# Altium schematic sheet LP_ECG_ECG-X01.SchDoc: ECG
size Letter; Organization: GEORGIA TECH; Address1: NORTH AVE NW; Address2: ATLANTA, GA, 30332; DocumentNumber: P001; Revision: X01; SheetNumber: 4; SheetTotal: 4
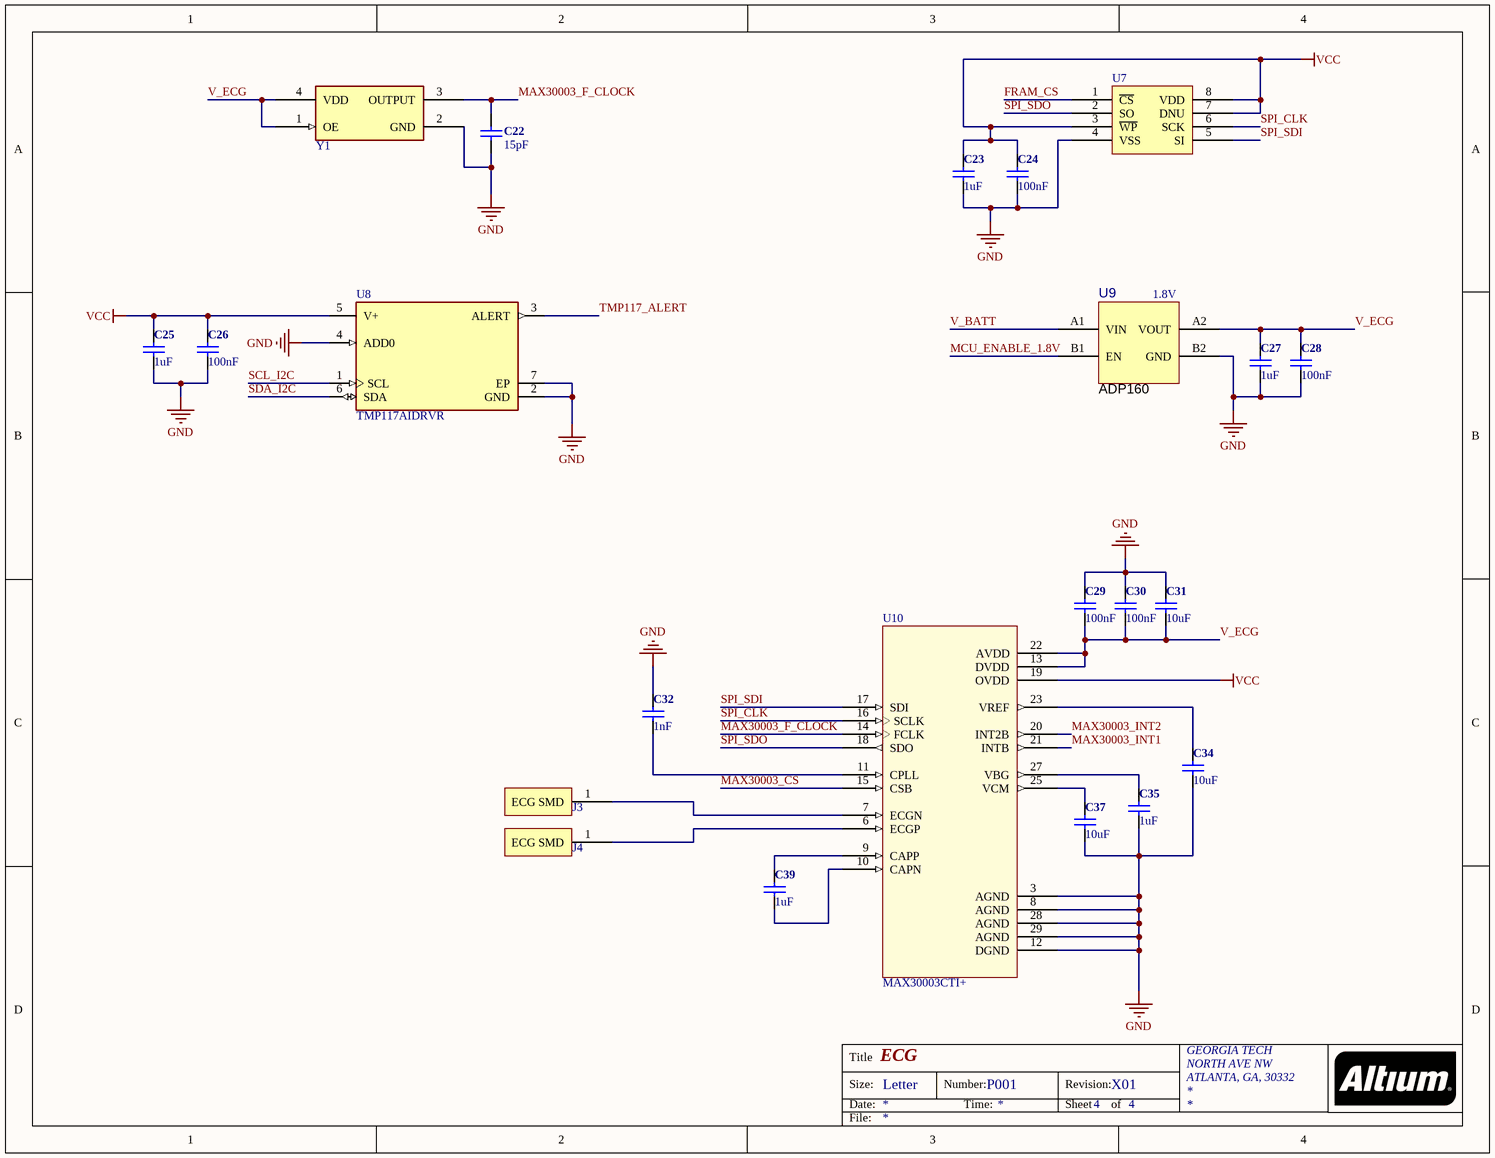
[diagram p0: LP_ECG_ECG-X01.SchDoc]

## Parts
C22  15pF  [C0402]
C23  1uF  [C0402]
C24  100nF  [C0402]
C25  1uF  [C0402]
C26  100nF  [C0402]
C27  1uF  [C0402]
C28  100nF  [C0402]
C29  100nF  [C0402]
C30  100nF  [C0402]
C31  10uF  [C0402]
C32  1nF  [C0402]
C34  10uF  [C0402]
C35  1uF  [C0402]
C37  10uF  [C0402]
C39  1uF  [C0402]
J3  ECG_SMD_CONNECTOR  [ecg_connector]  (value not drawn)
J4  ECG_SMD_CONNECTOR  [ecg_connector]  (value not drawn)
U7  8 MB FRAM  [GQFN-8]  (value not drawn)
U8  TMP117AIDRVR  [TMP117AIDRVR]
U9  ADP160  Output Voltage: 1.8V  [ADP160]
U10  MAX30003CTI+  [QFN50P500X500X80-29N]
Y1  OSCILLATOR-32.768KHZ  [OSCILLATOR_4-SMD]  (value not drawn)

## Nets
GND: C22.2 C23.2 C24.1 C25.2 C26.1 C27.2 C28.1 C29.1 C30.1 C31.1 C32.1 C34.2 C35.2 C37.2 U7.4(VSS) U8.2(GND) U8.4(ADD0) U8.7(EP) U9.B2(GND) U10.3(AGND) U10.8(AGND) U10.12(DGND) U10.28(AGND) U10.29(AGND) Y1.2(GND)
VCC: C23.1 C24.2 C25.1 C26.2 U7.3(~{WP}) U7.7(DNU) U7.8(VDD) U8.5(V+) U10.19(OVDD)
FRAM_CS: U7.1(~{CS})
MAX30003_CS: U10.15(CSB)
MAX30003_F_CLOCK: C22.1 U10.14(FCLK) Y1.3(OUTPUT)
MAX30003_INT1: U10.21(INTB)
MAX30003_INT2: U10.20(INT2B)
MCU_ENABLE_1.8V: U9.B1(EN)
SCL_I2C: U8.1(SCL)
SDA_I2C: U8.6(SDA)
SPI_CLK: U7.6(SCK) U10.16(SCLK)
SPI_SDI: U7.5(SI) U10.17(SDI)
SPI_SDO: U7.2(SO) U10.18(SDO)
TMP117_ALERT: U8.3(ALERT)
V_BATT: U9.A1(VIN)
V_ECG: C27.1 C28.2 C29.2 C30.2 C31.2 U9.A2(VOUT) U10.13(DVDD) U10.22(AVDD) Y1.1(OE) Y1.4(VDD)
NetC32_2: C32.2 U10.11(CPLL)
NetC34_1: C34.1 U10.23(VREF)
NetC35_1: C35.1 U10.27(VBG)
NetC37_1: C37.1 U10.25(VCM)
NetC39_1: C39.1 U10.9(CAPP)
NetC39_2: C39.2 U10.10(CAPN)
NetJ3_1: J3.1(ECG_SMD) U10.7(ECGN)
NetJ4_1: J4.1(ECG_SMD) U10.6(ECGP)

## Notes on the sheet
- Title
- Size:
- Date:
- Letter
- Number:
- Time:
- Revision:
- Sheet
- of
- File:

## Library data of the parts
C22 = C-0402(1005): Ceramic Capacitor, Multilayer, Ceramic, 50V, 1% +Tol, 1% -Tol, C0G, -/+30ppm/Cel TC, 0.000015uF, Surface Mount, 0402; Manufacturer: Murata; Manufacturer Part Number: GJM1555C1H150FB01D; ComponentLink1URL: https://datasheet.ciiva.com/169/product-169683.pdf; ComponentLink1Description: https://datasheet.ciiva.com/169/product-169683.pdf; Supplier 1: Digi-Key; Supplier Part Number 1: 490-11191-1-ND; RoHS: Yes; Category: Ceramic Capacitors; Stock 1: 66158; Pricing 1: 1=0.24000, 10=0.16700, 50=0.10000, 100=0.08440, 500=0.05778, 1000=0.05111, 2500=0.04888, 5000=0.04444 (USD); Mount: Surface Mount; Case/Package: 0402; Case Code (Imperial): 0402; Case Code (Metric): 1005; Min Operating Temperature: -55°C; Max Operating Temperature: 125°C; Capacitance: 15pF; Tolerance: 1%; Packaging: Tape and Reel; Voltage Rating: 50V; Voltage Rating (DC): 50V; Package Quantity: 10000; Dielectric: C0G; Termination: SMD/SMT; Voltage: 50V; Length: 1mm; Height: 0.5mm; Width: 0.02inch; Thickness: 0.022inch; Depth: 0.5mm; Radiation Hardening: No; ComponentLink2URL: https://datasheet.ciiva.com:443/pdfs/VipMasterIC/IC/MURE/MURE-S-A0004383799/MURE-S-A0004384018-1.pdf?src-supplier=IHS+Markit; ComponentLink2Description: https://datasheet.ciiva.com:443/pdfs/VipMasterIC/IC/MURE/MURE-S-A0004383799/MURE-S-A0004384018-1.pdf?src-supplier=IHS+Markit; ComponentLink3URL: https://datasheet.ciiva.com/11608/c02e-11608383.pdf?src-supplier=Avnet; ComponentLink3Description: https://datasheet.ciiva.com/11608/c02e-11608383.pdf?src-supplier=Avnet
C23 C25 C27 C35 C39 = C-0402(1005): Ceramic Capacitor, Multilayer, Ceramic, 6.3V, 20% +Tol, 20% -Tol, X5R, 15% TC, 1uF, Surface Mount, 0402; Manufacturer: Yageo; Manufacturer Part Number: CC0402MRX5R5BB105; Dissipation Factor: 10%; ComponentLink1URL: https://datasheet.ciiva.com/169/product-169683.pdf; ComponentLink1Description: https://datasheet.ciiva.com/169/product-169683.pdf; Supplier 1: Digi-Key; Supplier Part Number 1: 311-1441-1-ND; RoHS: Yes; Category: Ceramic Capacitors; Stock 1: 16697; Pricing 1: 1=0.13000, 10=0.08900, 100=0.04200, 500=0.02946, 1000=0.02439, 2500=0.02270, 5000=0.02076 (USD); Mount: Surface Mount; Case/Package: 0402; Number of Pins: 2; Case Code (Imperial): 0402; Case Code (Metric): 1005; Min Operating Temperature: -55°C; Max Operating Temperature: 85°C; Capacitance: 1uF; Tolerance: 20%; Voltage Rating: 6.3V; Voltage Rating (DC): 6.3V; Packaging: Tape and Reel; Package Quantity: 1; Dielectric: X5R; Termination: SMD/SMT; Composition: Ceramic; Length: 1mm; Height: 0.5mm; Width: 0.5mm; Thickness: 0.022inch; Depth: 0.5mm; Lead Free: Lead Free; Halogen Free: Halogen Free; ComponentLink2URL: https://datasheet.ciiva.com:443/pdfs/VipMasterIC/IC/YAGO/YAGO-S-A0006851646/YAGO-S-A0006851646-1.pdf?src-supplier=IHS+Markit; ComponentLink2Description: https://datasheet.ciiva.com:443/pdfs/VipMasterIC/IC/YAGO/YAGO-S-A0006851646/YAGO-S-A0006851646-1.pdf?src-supplier=IHS+Markit; ComponentLink3URL: https://datasheet.ciiva.com/176/mlccorderingcode-176806.pdf?src-supplier=Digi-Key; ComponentLink3Description: https://datasheet.ciiva.com/176/mlccorderingcode-176806.pdf?src-supplier=Digi-Key; ComponentLink4URL: https://datasheet.ciiva.com/176/mlccorderingcode-176807.pdf?src-supplier=Digi-Key; ComponentLink4Description: https://datasheet.ciiva.com/176/mlccorderingcode-176807.pdf?src-supplier=Digi-Key; ComponentLink5URL: https://datasheet.ciiva.com/176/mlccorderingcode-176808.pdf?src-supplier=Digi-Key; ComponentLink5Description: https://datasheet.ciiva.com/176/mlccorderingcode-176808.pdf?src-supplier=Digi-Key
C24 C26 C28 = C-0402(1005): Ceramic Capacitor, Multilayer, Ceramic, 25V, 10% +Tol, 10% -Tol, X5R, 15% TC, 0.1uF, Surface Mount, 0402; Manufacturer: Taiyo Yuden; Manufacturer Part Number: TMK105BJ104KV-F; ComponentLink1URL: https://datasheet.ciiva.com/169/product-169683.pdf; ComponentLink1Description: https://datasheet.ciiva.com/169/product-169683.pdf; Supplier 1: Digi-Key; Supplier Part Number 1: 587-1456-1-ND; RoHS: Yes; Category: Ceramic Capacitors; Stock 1: 27456801; Pricing 1: 1=0.10000, 10=0.04600, 100=0.02050, 500=0.01464, 1000=0.01150, 2500=0.01045, 5000=0.00961 (USD); Mount: Surface Mount; Case/Package: 0402; Number of Pins: 2; Weight: 2.3E-05oz; Case Code (Imperial): 0402; Case Code (Metric): 1005; Min Operating Temperature: -55°C; Max Operating Temperature: 85°C; Capacitance: 100nF; Tolerance: 10%; Packaging: Tape and Reel; Dielectric: X5R; Voltage Rating (DC): 25V; Voltage Rating: 25V; Package Quantity: 1; Termination: SMD/SMT; Composition: Ceramic; Voltage: 25V; Length: 1mm; Height: 0.5mm; Width: 0.5mm; Depth: 0.5mm; Thickness: 0.022inch; REACH SVHC: No SVHC; Lead Free: Lead Free; Halogen Free: Halogen Free; ComponentLink2URL: https://datasheet.ciiva.com:443/pdfs/VipMasterIC/IC/TAIY/TAIY-S-A0009103435/TAIY-S-A0009103038-1.pdf?src-supplier=IHS+Markit; ComponentLink2Description: https://datasheet.ciiva.com:443/pdfs/VipMasterIC/IC/TAIY/TAIY-S-A0009103435/TAIY-S-A0009103038-1.pdf?src-supplier=IHS+Markit; ComponentLink3URL: https://datasheet.ciiva.com/30051/25tmk105bj104kv-f-30051094.pdf?src-supplier=Onlinecomponents.com; ComponentLink3Description: https://datasheet.ciiva.com/30051/25tmk105bj104kv-f-30051094.pdf?src-supplier=Onlinecomponents.com; ComponentLink4URL: https://datasheet.ciiva.com/15922/28tmk105bj104kv-f-15922315.pdf?src-supplier=Onlinecomponents.com; ComponentLink4Description: https://datasheet.ciiva.com/15922/28tmk105bj104kv-f-15922315.pdf?src-supplier=Onlinecomponents.com; ComponentLink5URL: https://datasheet.ciiva.com/131/tmk105bj104kv-f-ss-131420.pdf?src-supplier=Digi-Key; ComponentLink5Description: https://datasheet.ciiva.com/131/tmk105bj104kv-f-ss-131420.pdf?src-supplier=Digi-Key; ComponentLink6URL: https://datasheet.ciiva.com/22768/1693457-22768649.pdf?src-supplier=Farnell; ComponentLink6Description: https://datasheet.ciiva.com/22768/1693457-22768649.pdf?src-supplier=Farnell
C29 C30 = C-0402(1005): Ceramic Capacitor, Multilayer, Ceramic, 25V, 10% +Tol, 10% -Tol, X5R, 15% TC, 0.1uF, Surface Mount, 0402; Manufacturer: Taiyo Yuden; Manufacturer Part Number: TMK105BJ104KV-F; Multilayer: Yes; ComponentLink1URL: https://datasheet.ciiva.com/169/product-169683.pdf; ComponentLink1Description: https://datasheet.ciiva.com/169/product-169683.pdf; Supplier 1: Digi-Key; Supplier Part Number 1: 587-1456-1-ND; RoHS: Yes; Category: Ceramic Capacitors; Stock 1: 17621987; Pricing 1: 1=0.10000, 10=0.04000, 50=0.02180, 100=0.01780, 500=0.01270, 1000=0.00998, 2500=0.00908, 5000=0.00835 (USD); Mount: Surface Mount; Number of Pins: 2; Dielectric Material: Ceramic; Package Shape: Rectangular; Size Code: 0402; Terminal Finish: Nickel; Min Operating Temperature: -55°C; Max Operating Temperature: 85°C; JESD-609 Code: e3; Capacitance: 100nF; Capacitor Type: Ceramic; Negative Tolerance: 10%; Package Style: SMTMeter; Packaging: Tape and Reel; Positive Tolerance: 10%; Rated DC Voltage (URdc): 25V; Temperature Characteristics Code: X5R; Termination: Wraparound; Length: 1mm; Width: 0.5mm; Height: 0.5mm; ComponentLink2URL: https://datasheet.ciiva.com:443/pdfs/VipMasterIC/IC/TAIY/TAIY-S-A0009103435/TAIY-S-A0009103038-1.pdf?src-supplier=IHS+Markit; ComponentLink2Description: https://datasheet.ciiva.com:443/pdfs/VipMasterIC/IC/TAIY/TAIY-S-A0009103435/TAIY-S-A0009103038-1.pdf?src-supplier=IHS+Markit; ComponentLink3URL: https://datasheet.ciiva.com/30051/25tmk105bj104kv-f-30051094.pdf?src-supplier=Onlinecomponents.com; ComponentLink3Description: https://datasheet.ciiva.com/30051/25tmk105bj104kv-f-30051094.pdf?src-supplier=Onlinecomponents.com; ComponentLink4URL: https://datasheet.ciiva.com/15922/28tmk105bj104kv-f-15922315.pdf?src-supplier=Onlinecomponents.com; ComponentLink4Description: https://datasheet.ciiva.com/15922/28tmk105bj104kv-f-15922315.pdf?src-supplier=Onlinecomponents.com; ComponentLink5URL: https://datasheet.ciiva.com/131/tmk105bj104kv-f-ss-131420.pdf?src-supplier=Digi-Key; ComponentLink5Description: https://datasheet.ciiva.com/131/tmk105bj104kv-f-ss-131420.pdf?src-supplier=Digi-Key; ComponentLink6URL: https://datasheet.ciiva.com/22768/1693457-22768649.pdf?src-supplier=Farnell; ComponentLink6Description: https://datasheet.ciiva.com/22768/1693457-22768649.pdf?src-supplier=Farnell
C31 C34 C37 = C-0402(1005): Ceramic Capacitor, Non-polarized, Multilayer, Ceramic, 10V, 20% +Tol, 20% -Tol, X5R, 15% TC, 10uF, Surface Mount, 0402; Manufacturer: Kyocera AVX; Manufacturer Part Number: 0402ZD106MAT2A; Multilayer: Yes; ComponentLink1URL: https://datasheet.ciiva.com/169/product-169683.pdf; ComponentLink1Description: https://datasheet.ciiva.com/169/product-169683.pdf; Supplier 1: Digi-Key; Supplier Part Number 1: 478-10052-1-ND; RoHS: No; Category: Ceramic Capacitors; Stock 1: 111382; Pricing 1: 1=0.85000, 10=0.62400, 50=0.49900, 100=0.42770, 500=0.33858, 1000=0.28512, 2500=0.26730, 5000=0.24948 (USD); Mount: Surface Mount; Number of Pins: 2; Dielectric Material: Ceramic; Package Shape: Rectangular; Size Code: 0402; Terminal Finish: Nickel; Min Operating Temperature: -55°C; Max Operating Temperature: 85°C; JESD-609 Code: e3; Capacitance: 10uF; Capacitor Type: Ceramic; Negative Tolerance: 20%; Packaging: Tape and Reel; Positive Tolerance: 20%; Rated DC Voltage (URdc): 10V; Temperature Characteristics Code: X5R; Termination: Wraparound; ComponentLink2URL: https://datasheet.ciiva.com:443/pdfs/VipMasterIC/IC/AVXC/AVXC-S-A0009640604/AVXC-S-A0009640604-1.pdf?src-supplier=IHS+Markit; ComponentLink2Description: https://datasheet.ciiva.com:443/pdfs/VipMasterIC/IC/AVXC/AVXC-S-A0009640604/AVXC-S-A0009640604-1.pdf?src-supplier=IHS+Markit; ComponentLink3URL: http://datasheets.avx.com/cx5r.pdf?src-supplier=Digi-Key; ComponentLink3Description: http://datasheets.avx.com/cx5r.pdf?src-supplier=Digi-Key; ComponentLink4URL: http://catalogs.avx.com/SurfaceMount.pdf?src-supplier=Digi-Key; ComponentLink4Description: http://catalogs.avx.com/SurfaceMount.pdf?src-supplier=Digi-Key
C32 = C-0402(1005): Ceramic Capacitor, Multilayer, Ceramic, 10V, 5% +Tol, 5% -Tol, C0G, -/+30ppm/Cel TC, 0.001uF, 0402; Manufacturer: KEMET; Manufacturer Part Number: C0402C102J8GAC7867; ComponentLink1URL: https://datasheet.ciiva.com/169/product-169683.pdf; ComponentLink1Description: https://datasheet.ciiva.com/169/product-169683.pdf; Supplier 1: Digi-Key; Supplier Part Number 1: 399-14868-1-ND; RoHS: No; Category: Ceramic Capacitors; Stock 1: 20757; Pricing 1: 1=0.26000, 10=0.18100, 100=0.10240, 500=0.07226, 1000=0.06322, 2500=0.06022, 5000=0.05570 (USD); Mount: Surface Mount; Case/Package: 0402; Case Code (Imperial): 0402; Case Code (Metric): 1005; Min Operating Temperature: -55°C; Max Operating Temperature: 125°C; Packaging: Tape and Reel; Capacitance: 1nF; Tolerance: 5%; Voltage Rating: 10V; ComponentLink2URL: https://datasheet.ciiva.com:443/pdfs/VipMasterIC/IC/KEME/KEMES02331/KEMES02331-1.pdf?src-supplier=IHS+Markit; ComponentLink2Description: https://datasheet.ciiva.com:443/pdfs/VipMasterIC/IC/KEME/KEMES02331/KEMES02331-1.pdf?src-supplier=IHS+Markit; ComponentLink3URL: https://api.kemet.com/component-edge/download/datasheet/C0402C102J8GAC7867.pdf?src-supplier=Digi-Key; ComponentLink3Description: https://api.kemet.com/component-edge/download/datasheet/C0402C102J8GAC7867.pdf?src-supplier=Digi-Key
J3 J4 = ECG_SMD_CONNECTOR: SMD CONNECTOR FOR ECG
U7 = CY15B108QI: Memory Circuit, 8 MB FRAM; Manufacturer: Cypress; Manufacturer Part Number: CY15B108QI-20LPXI; Supplier 1: Digi-Key; Supplier Part Number 1: 428-4721-ND; RoHS: No; Category: Memory; Stock 1: 1421; Pricing 1: 1=32.50000, 10=30.55500, 25=29.50560, 50=28.56820, 100=25.13780, 250=24.46300, 500=23.71318, 1000=23.43200 (USD); ComponentLink1URL: https://datasheet.ciiva.com:443/pdfs/VipMasterIC/IC/CYPR/CYPR-S-A0008987076/CYPR-S-A0008987076-1.pdf?src-supplier=IHS+Markit; ComponentLink1Description: https://datasheet.ciiva.com:443/pdfs/VipMasterIC/IC/CYPR/CYPR-S-A0008987076/CYPR-S-A0008987076-1.pdf?src-supplier=IHS+Markit
U8 = bceab6869a9cb85cf5675529ee35ce4: TEMPERATURE SENSOR; Manufacturer: Texas Instruments; Operating Supply Current: 3.5-16uA; Standoff Height: 0mm; Min Supply Voltage: 1.8V; Resolution: 16bits; Interface: I2C,2-Wire,SMBus; Max Junction Temp: +150°C; Max Supply Voltage: 5.5V; Output Type: I2C; Octopart: https://octopart.com/tmp117aidrvr-texas+instruments-95511044; Lead Free: Yes; ComponentLink2Description: Datasheet; Temperature Range High: +150°C; Manufacturer Part Number: TMP117AIDRVR; Ambient Temperature Range High: +150°C; Ambient Temperature Range Low: -55°C; Height: 0.8mm; ComponentLink2URL: http://www.ti.com/lit/ds/symlink/tmp117.pdf; Automotive: No; Device Class L1: Sensors; RoHS: TRUE; Package: DRV0006A; Device Class L3: unset; Temperature: -55°C to +150°C; Temperature Range Low: -55°C; Ipc Land Pattern Name: DFN200X200X80-6; Device Class L2: Temperature and Humidity Sensors; Category: IC; Digikey Description: TEMPERATURE SENSOR; Supplier 1: Digi-Key; Supplier Part Number 1: 296-51834-1-ND; Stock 1: 3558; Pricing 1: 1=8.02000, 5=7.07600, 10=6.25000, 25=5.07040, 50=4.48100, 100=4.36300, 500=3.65552, 1000=3.41968 (USD); Mount: Surface Mount; Min Operating Temperature: -55°C; Max Operating Temperature: 150°C; Packaging: Cut Tape; ComponentLink1URL: https://www.ti.com:443/lit/ds/symlink/tmp117.pdf?src-supplier=IHS+Markit; ComponentLink1Description: https://www.ti.com:443/lit/ds/symlink/tmp117.pdf?src-supplier=IHS+Markit; ComponentLink3URL: http://www.ti.com/lit/gpn/tmp117?src-supplier=Digi-Key; ComponentLink3Description: http://www.ti.com/lit/gpn/tmp117?src-supplier=Digi-Key
U9 = ADP160-1_8V: Fixed Positive LDO Regulator, 1.8V, 0.195V Dropout, CMOS, PBGA4; Manufacturer: Analog Devices; Manufacturer Part Number: ADP160ACBZ-1.8-R7; Max Output Current: 150mA; Min Input Voltage: 2.2V; Max Input Voltage: 5.5V; Number of Outputs: 1; Operating Supply Current: 42uA; Min Output Voltage: 1.2V; Max Output Voltage: 4.2V; Accuracy: 2%; Power Supply Rejection Ratio (PSRR): 60dB; Min Current Limit: 220mA; Quiescent Current: 0pA; Supplier 1: Digi-Key; Supplier Part Number 1: ADP160ACBZ-1.8-R7CT-ND; RoHS: Yes; Category: Voltage Regulators - Linear; Stock 1: 5770; Pricing 1: 1=1.12000, 10=1.00300, 25=0.95200, 100=0.73100, 250=0.64600, 500=0.61200, 1000=0.49300 (USD); Mount: Surface Mount; Number of Pins: 4; Contact Plating: Copper,Tin,Silver; Min Operating Temperature: -40°C; Max Operating Temperature: 125°C; Packaging: Tape and Reel; Output Current: 150mA; Nominal Supply Current: 42uA; Output Type: Fixed; Polarity: Positive; Max Supply Current: 42uA; Number of Regulators: 1; Package Quantity: 1; Output Voltage Accuracy: 2%; Length: 1mm; Height: 0.37mm; Width: 1mm; Radiation Hardening: No; Lead Free: Contains Lead; ComponentLink1URL: https://datasheet.ciiva.com:443/pdfs/VipMasterIC/IC/ANDI/ANDI-S-A0005865400/ANDI-S-A0005865400-1.pdf?src-supplier=IHS+Markit; ComponentLink1Description: https://datasheet.ciiva.com:443/pdfs/VipMasterIC/IC/ANDI/ANDI-S-A0005865400/ANDI-S-A0005865400-1.pdf?src-supplier=IHS+Markit; ComponentLink2URL: https://datasheet.ciiva.com/15270/adp160-161-162-163-15270706.pdf?src-supplier=Arrow+Europe; ComponentLink2Description: https://datasheet.ciiva.com/15270/adp160-161-162-163-15270706.pdf?src-supplier=Arrow+Europe; ComponentLink3URL: https://datasheet.ciiva.com/18552/adp160-161-162-163-18552055.pdf?src-supplier=Digi-Key; ComponentLink3Description: https://datasheet.ciiva.com/18552/adp160-161-162-163-18552055.pdf?src-supplier=Digi-Key; ComponentLink4URL: https://datasheet.ciiva.com/18552/adp160-161-162-163-18552056.pdf?src-supplier=Digi-Key; ComponentLink4Description: https://datasheet.ciiva.com/18552/adp160-161-162-163-18552056.pdf?src-supplier=Digi-Key; ComponentLink5URL: https://datasheet.ciiva.com/18552/adp160-161-162-163-18552054.pdf?src-supplier=Digi-Key; ComponentLink5Description: https://datasheet.ciiva.com/18552/adp160-161-162-163-18552054.pdf?src-supplier=Digi-Key; ComponentLink6URL: https://datasheet.ciiva.com/3224/adp160-161-162-163-3224663.pdf?src-supplier=Avnet; ComponentLink6Description: https://datasheet.ciiva.com/3224/adp160-161-162-163-3224663.pdf?src-supplier=Avnet
U10 = MAX30003CTI+: Analog Circuit, 1 Func, CMOS; Manufacturer: Maxim; Min Supply Voltage: 1.2V; Max Supply Voltage: 2V; Supplier 1: Digi-Key; Supplier Part Number 1: MAX30003CTI+-ND; RoHS: No; Category: RF Semiconductors and Devices; Stock 1: 286; Pricing 1: 1=8.21000, 10=7.41200, 25=7.06760, 100=5.86090, 250=5.34380, 500=4.99902, 1000=4.98888 (USD); Number of Pins: 28; Min Operating Temperature: 0°C; Max Operating Temperature: 70°C; REACH SVHC: No SVHC; ComponentLink1URL: https://datasheet.ciiva.com:443/pdfs/VipMasterIC/IC/MAXM/MAXM-S-A0009086108/MAXM-S-A0009086108-1.pdf?src-supplier=IHS+Markit; ComponentLink1Description: https://datasheet.ciiva.com:443/pdfs/VipMasterIC/IC/MAXM/MAXM-S-A0009086108/MAXM-S-A0009086108-1.pdf?src-supplier=IHS+Markit; ComponentLink2URL: http://www.farnell.com/datasheets/2159846.pdf?src-supplier=Farnell; ComponentLink2Description: http://www.farnell.com/datasheets/2159846.pdf?src-supplier=Farnell; ComponentLink3URL: https://pdfserv.maximintegrated.com/en/an/MAX-ECG-MONITOR-User-Guide.pdf?src-supplier=Digi-Key; ComponentLink3Description: https://pdfserv.maximintegrated.com/en/an/MAX-ECG-MONITOR-User-Guide.pdf?src-supplier=Digi-Key; ComponentLink4URL: http://www.farnell.com/datasheets/2159846.pdf?src-supplier=Element14; ComponentLink4Description: http://www.farnell.com/datasheets/2159846.pdf?src-supplier=Element14; Manufacturer Part Number: MAX30003CTI+
Y1 = OSCILLATOR_32K768: Oscillator Xo 0.032768MHZ ±25PPM 15PF Lvcmos/lvttl 55% 1.8V 4-PIN Csmd T/r; Manufacturer: Diodes Inc.; Manufacturer Part Number: KX2013B0032.768000; Supplier 1: Digi-Key; Supplier Part Number 1: 31-KX2013B0032.768000CT-ND; Category: Oscillators; Stock 1: 1555; Pricing 1: 1=2.90000, 10=2.83500, 50=2.70000, 100=2.36250, 500=2.29500, 1000=1.95750 (USD); ComponentLink1URL: http://www.mouser.com/ds/2/322/KX201-Rev-A-461590.pdf?src-supplier=Mouser; ComponentLink1Description: http://www.mouser.com/ds/2/322/KX201-Rev-A-461590.pdf?src-supplier=Mouser; ComponentLink2URL: https://www.pericom.com/assets/Datasheets/KX201.pdf?src-supplier=Digi-Key; ComponentLink2Description: https://www.pericom.com/assets/Datasheets/KX201.pdf?src-supplier=Digi-Key; ComponentLink3URL: https://www.diodes.com/assets/Datasheets/KX201.pdf?src-supplier=Digi-Key; ComponentLink3Description: https://www.diodes.com/assets/Datasheets/KX201.pdf?src-supplier=Digi-Key